# Altium project AMG8833convert.PrjPcb
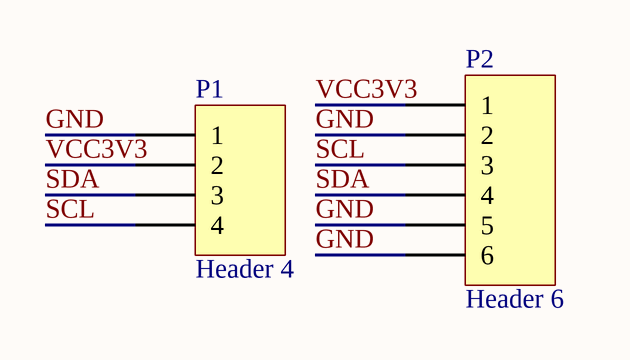
[diagram p0: AMG8833convert.SchDoc]
1 sheet, 2 parts. Net scope: global (net labels, ports and power ports of the same name join across sheets).
Board file: AMG8833convert.PcbDoc

## Sheet AMG8833convert.SchDoc
size A4

### Parts
P1  Header 4  [HDR1X4]
P2  Header 6  [HDR1X6]

### Nets
GND: P1.1 P2.2 P2.5 P2.6
SCL: P1.4 P2.3
SDA: P1.3 P2.4
VCC3V3: P1.2 P2.1

### Library data of the parts
P1 = Header 4: Header, 4-Pin; LatestRevisionDate: 17-Jul-2002; LatestRevisionNote: Re-released for DXP Platform.; Publisher: Altium Limited
P2 = Header 6: Header, 6-Pin; LatestRevisionDate: 17-Jul-2002; LatestRevisionNote: Re-released for DXP Platform.; Publisher: Altium Limited